# EAGLE design MEMS_ADC (EAGLE 6.1)
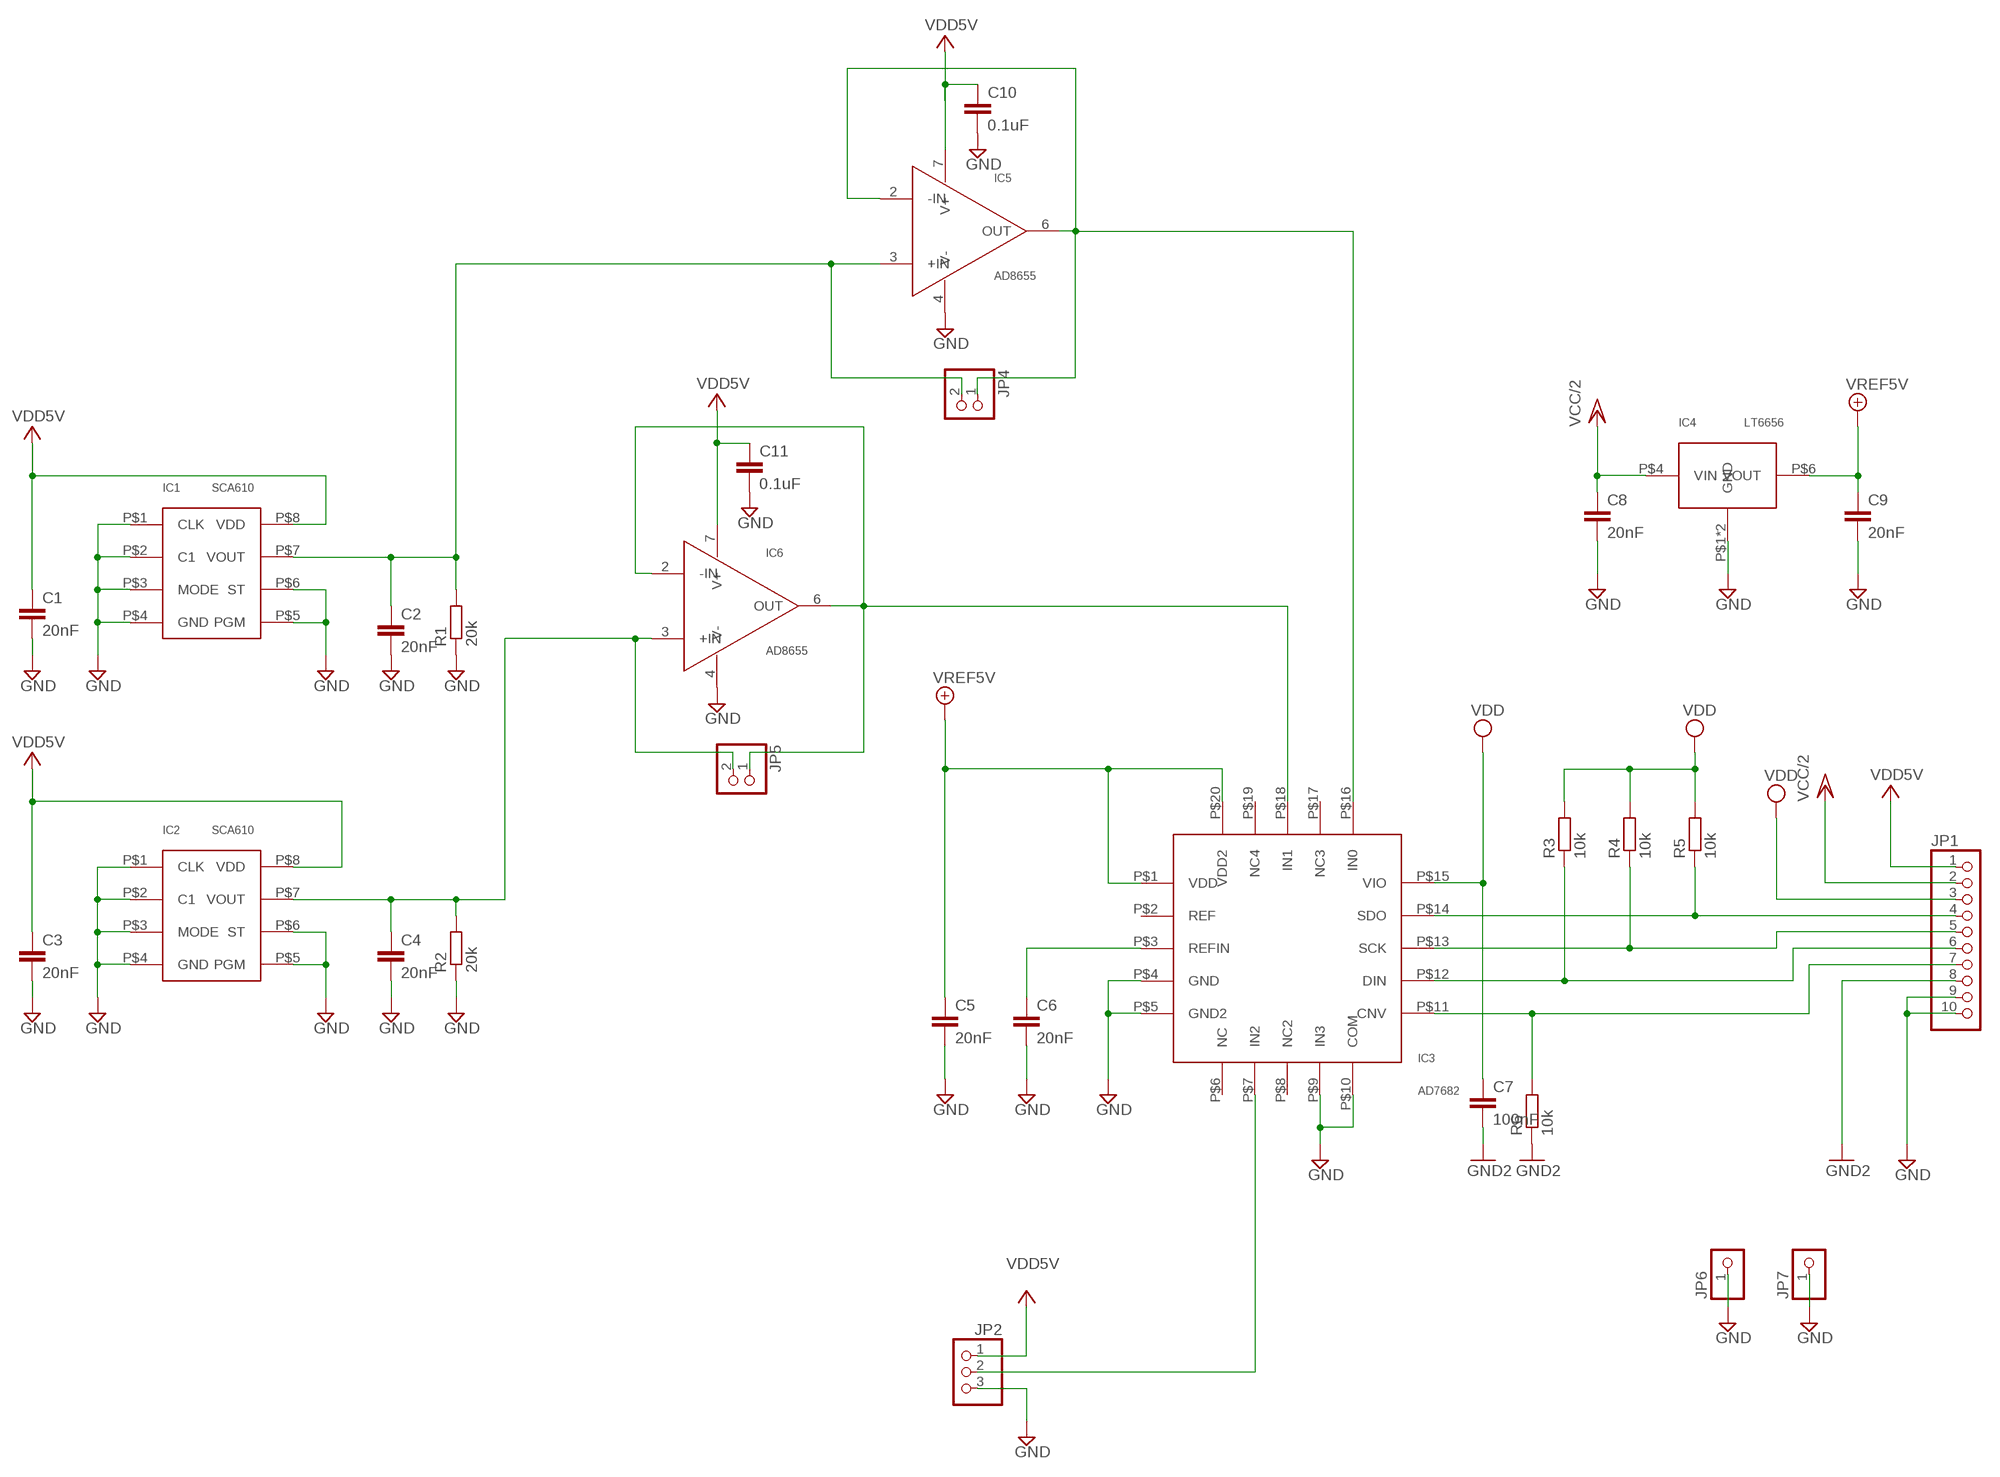
[diagram p0: schematic, sheet 1]

## Parts
C1  20nF  C-EUC0805  [C0805]
C2  20nF  C-EUC0805  [C0805]
C3  20nF  C-EUC0805  [C0805]
C4  20nF  C-EUC0805  [C0805]
C5  20nF  C-EUC0805  [C0805]
C6  20nF  C-EUC0805  [C0805]
C7  100nF  C-EUC0805  [C0805]
C8  20nF  C-EUC0805  [C0805]
C9  20nF  C-EUC0805  [C0805]
C10  0.1uF  C-EUC0805  [C0805]
C11  0.1uF  C-EUC0805  [C0805]
IC1  SCA610  SCA610-D14H11  [SCA610-D14H1]
IC2  SCA610  SCA610-D14H11  [SCA610-D14H1]
IC3  AD7682  [AD7682]
IC4  LT6656  [SOT23-6]
IC5  AD8655  [SOIC8]
IC6  AD8655  [SOIC8]
JP1  PINHD-1X10  [1X10]
JP2  PINHD-1X3  [1X03]
JP4  PINHD-1X2  [1X02]
JP5  PINHD-1X2  [1X02]
JP6  PINHD-1X1  [1X01]
JP7  PINHD-1X1  [1X01]
R1  20k  R-EU_R0805  [R0805]
R2  20k  R-EU_R0805  [R0805]
R3  10k  R-EU_R0805  [R0805]
R4  10k  R-EU_R0805  [R0805]
R5  10k  R-EU_R0805  [R0805]
R6  10k  R-EU_R0805  [R0805]

## Nets
+5V: C5.1 C9.1 IC3.P$1(VDD) IC3.P$20(VDD2) IC4.P$6(VOUT) ; supply symbol labelled VREF5V
GND: C1.2 C2.2 C3.2 C4.2 C5.2 C6.2 C7.2 C8.2 C9.2 C10.2 C11.2 IC1.P$1(CLK) IC1.P$2(C1) IC1.P$3(MODE) IC1.P$4(GND) IC1.P$5(PGM) IC1.P$6(ST) IC2.P$1(CLK) IC2.P$2(C1) IC2.P$3(MODE) IC2.P$4(GND) IC2.P$5(PGM) IC2.P$6(ST) IC3.P$4(GND) IC3.P$5(GND2) IC3.P$9(IN3) IC3.P$10(COM) IC4.P$1(GND) IC4.P$2(GND) IC5.4(V-) IC6.4(V-) JP1.8 JP1.9 JP1.10 JP2.3 JP6.1 JP7.1 R1.1 R2.1 R6.1 ; supply symbol labelled GND2
N$1: C4.1 IC2.P$7(VOUT) IC6.3(+IN) JP5.2 R2.2
N$4: IC3.P$11(CNV) JP1.7 R6.2
N$5: C6.1 IC3.P$3(REFIN)
N$6: IC3.P$12(DIN) JP1.6 R3.1
N$7: IC3.P$13(SCK) JP1.5 R4.1
N$8: IC3.P$14(SDO) JP1.4 R5.1
N$9: C2.1 IC1.P$7(VOUT) IC5.3(+IN) JP4.2 R1.2
N$10: IC3.P$7(IN2) JP2.2
N$13: IC3.P$16(IN0) IC5.2(-IN) IC5.6(OUT) JP4.1
N$14: IC3.P$18(IN1) IC6.2(-IN) IC6.6(OUT) JP5.1
VCC: C1.1 C3.1 C10.1 C11.1 IC1.P$8(VDD) IC2.P$8(VDD) IC5.7(V+) IC6.7(V+) JP1.1 JP2.1 ; supply symbol labelled VDD5V
VCC/2: C8.1 IC4.P$4(VIN) JP1.2
VDD: C7.1 IC3.P$15(VIO) JP1.3 R3.2 R4.2 R5.2
Unconnected: IC3.P$2(REF) IC3.P$6(NC) IC3.P$8(NC2) IC3.P$17(NC3) IC3.P$19(NC4)

## Library data of the parts
C1-C11 = rcl:C-EU: CAPACITOR, European symbol
IC1 IC2 = OpenEQ:SCA610-D14H11
IC3 = OpenEQ:AD7682
IC4 = OpenEQ:LT6656
IC5 IC6 = OpenEQ:AD8655: 低ノイズ高精度CMOSアンプ パッケージに可能な限り近接に0.1uF(X7R or NPO)のチップコンデンサを配置すること。 4.7uFのタンタルコンデンサを各ボードにつき1個は配置すること。
JP1 = pinhead:PINHD-1X10: PIN HEADER
JP2 = pinhead:PINHD-1X3: PIN HEADER
JP4 JP5 = pinhead:PINHD-1X2: PIN HEADER
JP6 JP7 = pinhead:PINHD-1X1: PIN HEADER
R1-R6 = rcl:R-EU_: RESISTOR, European symbol

## Board
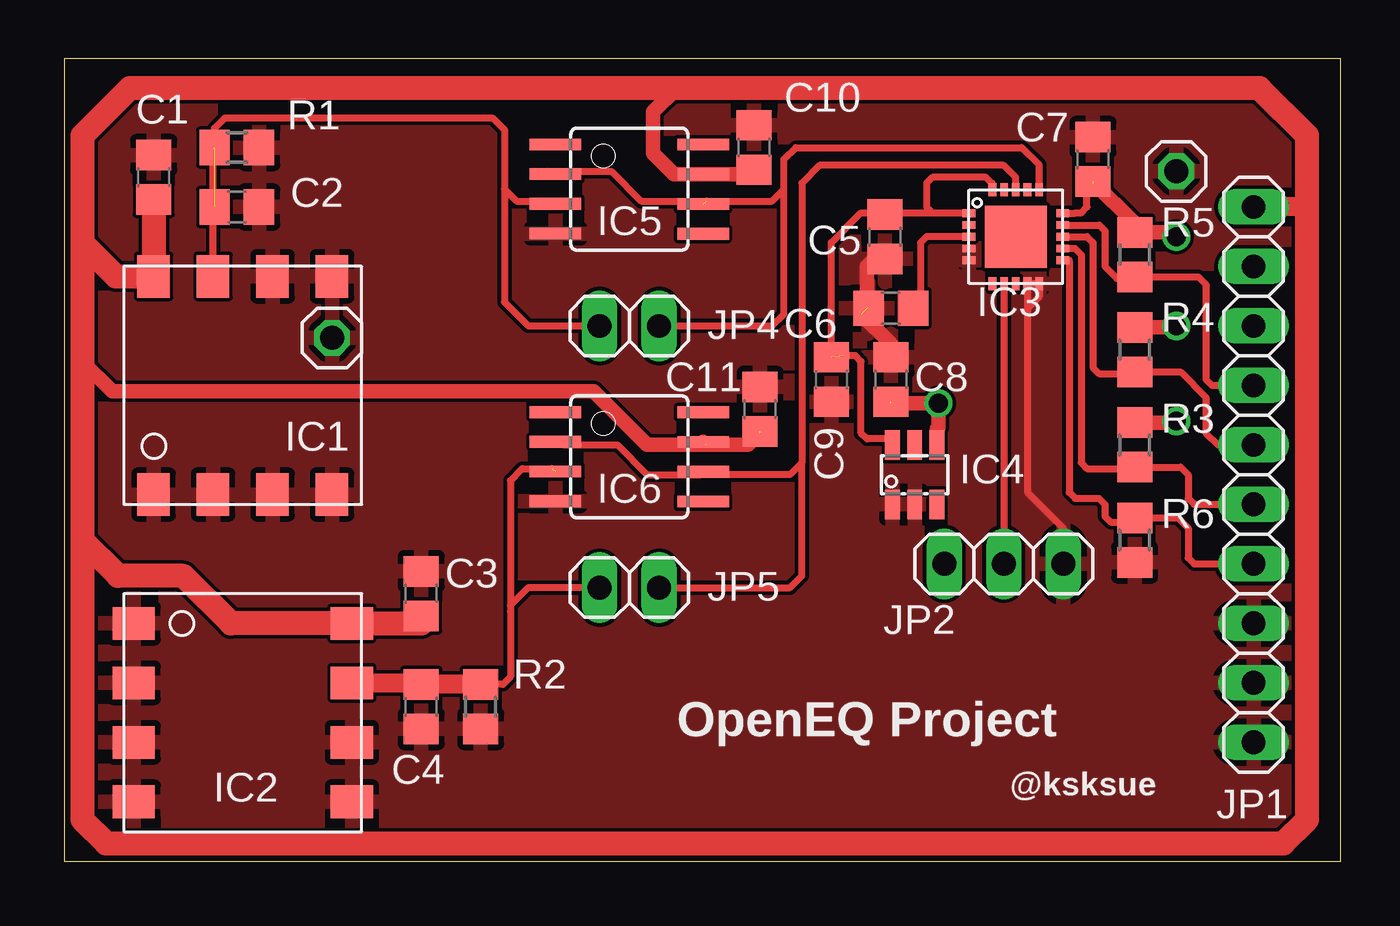
[diagram p1: board, top side]
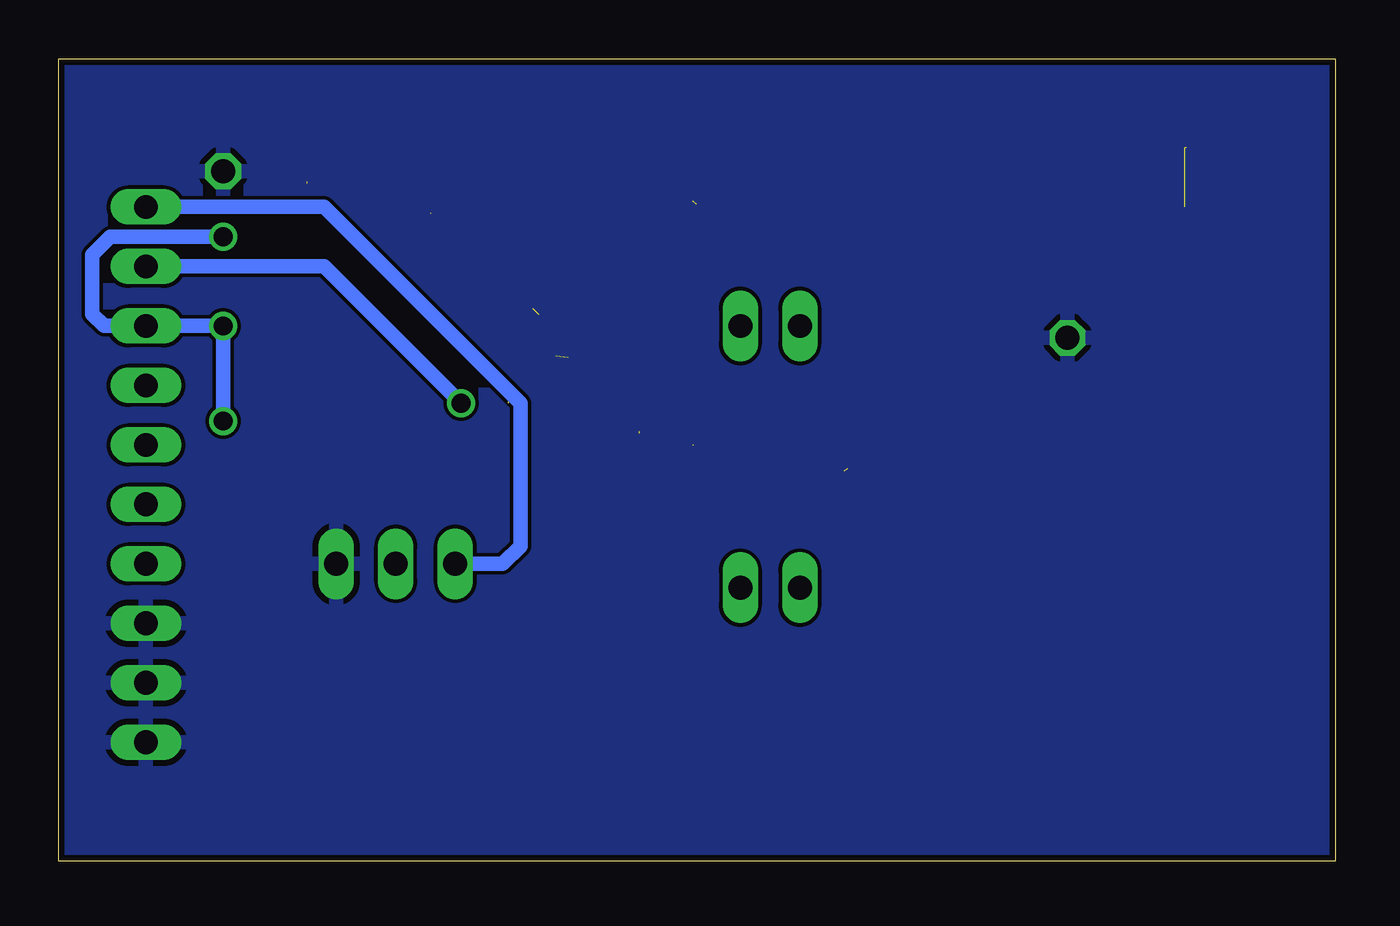
[diagram p2: board, bottom side, seen from below]

Size 54.53 x 34.28 mm. Coordinates in mm from the lower left corner, seen from the top.
Outline: 0,0 54.53,0 54.53,34.28 0,34.28 0,0
Copper layers (1*16): Top 0.035mm / dielectric 1.5mm / Bottom 0.035mm
Design rules: minimum track width 6mil, minimum drill 12mil, track to track 6mil, track to pad 6mil, pad to pad 6mil, via to via 6mil, smd to smd 0mil, copper to edge 10mil, drill to drill 10mil, minimum pad ring 10mil, minimum via ring 6mil, stop-mask expansion 2mil, vias tented up to drill 100mil, thermal gap 10mil

### Footprints (pad centres in the part's own frame; a part is rotated, then mirrored left to right if it is on the bottom)
C0805 = smd 1.3 x 1.5: 1 -0.95,0; 2 0.95,0
SCA610-D14H1 = smd 1.81 x 1.39: P$1 -4.66,3.81; P$2 -4.66,1.27; P$3 -4.66,-1.27; P$4 -4.66,-3.81; P$5 4.66,-3.81; P$6 4.66,-1.27; P$7 4.66,1.27; P$8 4.66,3.81
AD7682 = smd 0.55 x 0.33: P$1 -2,1; P$2 -2,0.5; P$3 -2,0; P$4 -2,-0.5; P$5 -2,-1; P$11 2,-1; P$12 2,-0.5; P$13 2,0; P$14 2,0.5; P$15 2,1 | smd 0.33 x 0.55: P$6 -1,-2; P$7 -0.5,-2; P$8 0,-2; P$9 0.5,-2; P$10 1,-2; P$16 1,2; P$17 0.5,2; P$18 0,2; P$19 -0.5,2; P$20 -1,2 | smd 2.65 x 2.65: P$21 0,0
SOT23-6 = smd 0.635 x 1.27: P$1 -0.953,-1.27; P$2 0,-1.27; P$3 0.953,-1.27; P$4 0.953,1.27; P$5 0,1.27; P$6 -0.953,1.27
SOIC8 = smd 0.5 x 2.2: 1 -1.905,-3.154; 2 -0.645,-3.154; 3 0.625,-3.154; 4 1.895,-3.154; 5 1.905,3.154; 6 0.635,3.154; 7 -0.635,3.154; 8 -1.905,3.154
1X10 = drill 1.016 long: 1 -11.43,0; 2 -8.89,0; 3 -6.35,0; 4 -3.81,0; 5 -1.27,0; 6 1.27,0; 7 3.81,0; 8 6.35,0; 9 8.89,0; 10 11.43,0
1X03 = drill 1.016 long: 1 -2.54,0; 2 0,0; 3 2.54,0
1X02 = drill 1.016 long: 1 -1.27,0; 2 1.27,0
1X01 = drill 1.016 octagon: 1 0,0
R0805 = smd 1.3 x 1.5: 1 -0.95,0; 2 0.95,0

### Placement (x,y rotation side)
C1  3.81,29.21 90 top
C2  7.37,27.94 0 top
C3  15.24,11.43 90 top
C4  15.24,6.6 270 top
C5  35.05,26.67 270 top
C6  35.31,23.62 180 top
C7  43.94,29.97 90 top
C8  35.31,20.57 90 top
C9  32.77,20.57 270 top
C10  29.46,30.48 90 top
C11  29.72,19.3 90 top
IC1  7.62,20.32 90 top
IC2  7.62,6.35 0 top
IC3  40.64,26.67 0 top
IC4  36.32,16.51 0 top
IC5  24.13,28.7 270 top
IC6  24.13,17.27 270 top
JP1  50.8,16.51 270 top
JP2  40.13,12.7 0 top
JP4  24.13,22.86 180 top
JP5  24.13,11.68 180 top
JP6  11.43,22.35 0 top
JP7  47.5,29.46 0 top
R1  7.37,30.48 180 top
R2  17.78,6.6 90 top
R3  45.72,17.78 90 top
R4  45.72,21.84 90 top
R5  45.72,25.91 90 top
R6  45.72,13.72 90 top

### Tracks (layer width: path | path; a pad name or v marks a point on that pad's centre or on a via)
+5V  (2 unrouted)
  Top 0.305: IC3.P$20 39.62,28.69 39.62,28.96 39.37,29.21 37.08,29.21 36.83,28.96 36.83,27.94 37.08,27.69 38.61,27.69 | IC3.P$1 35.1,27.67 C5.1 34.99,27.69 34.04,27.69 32.77,26.42 C9.1 | IC4.P$6 35.37,17.97 35.31,18.03 34.29,18.03 34.04,18.29 34.04,21.34 33.78,21.59 33.27,21.59
GND  (1 unrouted)
  Top 0.305: JP2.3 42.67,14.22 41.14,15.76 IC3.P$9 IC3.P$10 41.64,24.11 41.15,23.62
  Top 0.61: C5.2 34.61,25.72 34.29,25.4 34.29,23.62 | C8.2 35.31,22.1 34.04,23.37
  pour Bottom: -0.76,35.05 55.63,35.05 55.63,-1.02 -1.02,-1.02 -0.76,34.8
  pour Top: -0.76,35.31 55.37,35.31 55.37,-1.02 -1.27,-1.02 -1.02,35.81
N$1  (1 unrouted)
  Top 0.305: 17.97,7.55 R2.2 18.73,7.55 19.05,7.87 19.05,10.67 19.05,10.92 | 20.83,16.76 19.56,16.76 19.05,16.26 19.05,10.92 | JP5.2 19.81,11.68 19.05,10.92
  Top 0.813: IC2.P$7 15.17,7.62 C4.1 R2.2
N$4
  Top 0.305: IC3.P$11 42.91,25.67 42.93,25.65 42.93,15.75 43.18,15.49 44.2,15.49 44.45,15.24 44.45,14.73 44.7,14.48 45.53,14.48 R6.2 47.56,14.67 48.01,14.22 48.01,12.95 48.26,12.7 JP1.7
N$5
  Top 0.305: IC3.P$3 36.83,26.67 36.58,26.42 36.58,23.94 C6.1
N$6
  Top 0.305: IC3.P$12 43.17,26.17 43.43,25.91 43.43,17.02 43.69,16.76 45.65,16.76 R3.1 47.69,16.83 48.01,16.51 48.01,15.49 48.26,15.24 JP1.6
N$7
  Top 0.305: IC3.P$13 43.69,26.67 43.94,26.42 43.94,21.08 44.2,20.83 45.65,20.83 R4.1 47.69,20.89 48.77,19.81 48.77,18.29 49.28,17.78 JP1.5
N$8
  Top 0.305: IC3.P$14 44.2,27.17 44.45,26.92 44.45,25.4 44.96,24.89 45.65,24.89 R5.1 48.45,24.96 48.77,24.64 48.77,20.57 49.02,20.32 JP1.4
N$9  (2 unrouted)
  Top 0.305: R1.2 6.42,31.31 6.86,31.75 18.29,31.75 18.8,31.24 18.8,28.7 | IC5.3 20.86,28.19 19.3,28.19 18.8,28.7 | IC1.P$7 6.35,30.48 | JP4.2 19.81,22.86 18.8,23.88 18.8,28.7
N$10
  Top 0.305: IC3.P$7 40.14,12.96 JP2.2
N$13  (1 unrouted)
  Top 0.305: IC3.P$16 41.64,29.73 40.89,30.48 31.24,30.48 30.73,29.97 30.73,28.7 | JP4.1 30.23,22.86 30.73,23.37 30.73,28.7 | IC5.2 20.57,29.46 23.37,29.46 24.64,28.19 26.67,28.19 IC5.6 | 27.43,28.19 30.23,28.19 30.73,28.7
N$14
  Top 0.305: IC3.P$18 40.64,29.21 40.13,29.72 32.26,29.72 31.5,28.96 31.5,17.02 | 31.5,17.02 30.99,16.51 27.66,16.51 IC6.6 27.18,16.51 24.89,16.51 23.62,17.78 21.34,17.78 IC6.2 | JP5.1 30.99,11.68 31.5,12.19 31.5,17.02
VCC  (2 unrouted)
  Top 0.61: IC6.7 27.41,17.78 29.21,17.78 29.72,18.29 | 27.43,17.78 24.89,17.78 22.61,20.07 2.03,20.07 0.76,21.34 | C10.1 29.52,29.34 IC5.7 26.04,29.34 25.15,30.23 25.15,32 26.16,33.02
  Top 0.813: 53.09,27.94 JP1.1
  Top 1.016: C1.1 IC1.P$8 2.2,24.98 0.76,26.42 | 0.76,26.42 0.76,30.99 2.79,33.02 26.16,33.02 51.05,33.02 53.09,30.99 53.09,27.94 53.09,1.78 52.07,0.76 1.78,0.76 0.76,1.78 0.76,13.72 | 0.76,26.42 0.76,21.34 0.76,13.72 | C3.1 15.24,10.16 IC2.P$8 7.11,10.16 5.08,12.19 2.29,12.19 0.76,13.72
  Bottom 0.61: JP2.1 35.56,12.7 34.8,13.46 34.8,19.56 43.18,27.94 JP1.1
VCC/2  (via drill 0.8)  (1 unrouted)
  Top 0.61: IC4.P$4 37.27,18.48 37.34,18.54 v37.34,19.56 35.31,19.56
  Bottom 0.61: v37.34,19.56 43.18,25.4 JP1.2
VDD  (via drill 0.8)  (1 unrouted)
  Top 0.305: IC3.P$15 43.16,27.67 43.18,27.69 43.43,27.69 43.69,27.94 43.69,28.7 43.94,28.96
  Top 0.61: C7.1 45.72,27.24 R5.2 47.31,26.86 v47.5,26.67 | R4.2 47.43,22.79 v47.5,22.86 | R3.2 47.43,18.73 v47.5,18.8
  Bottom 0.61: v47.5,26.67 52.32,26.67 53.09,25.91 53.09,23.37 52.58,22.86 JP1.3 v47.5,22.86 v47.5,18.8

### Text on the board
tNames: OpenEQ Project | @ksksue